# EAGLE design wemos-d1-screw-terminal-v2.0 (EAGLE 9.6.2)
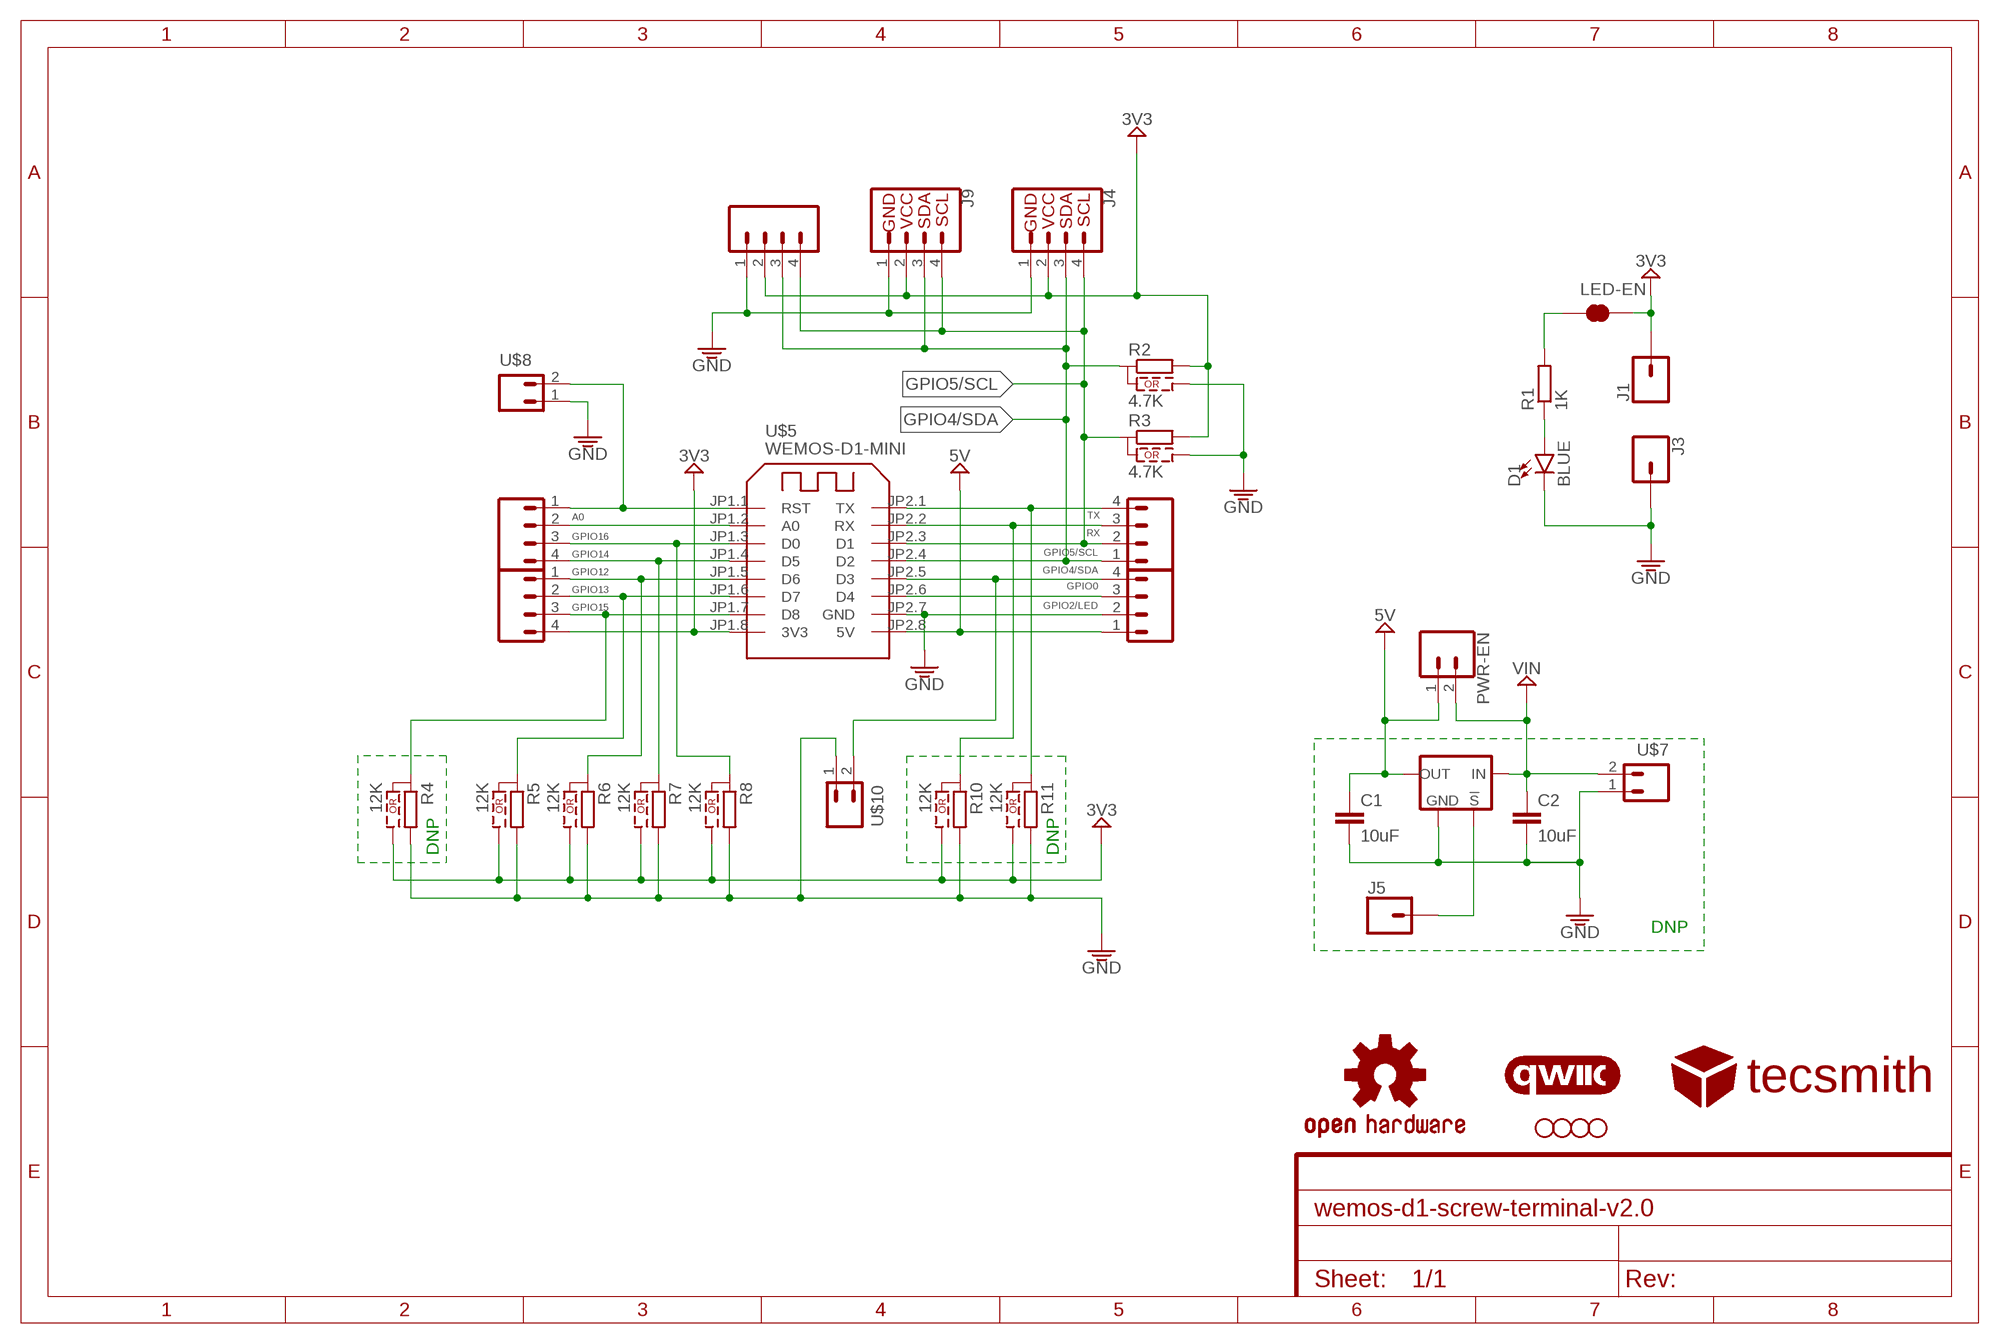
[diagram p0: schematic, sheet 1]

## Parts
C1  10uF  10UF-0805-10V-10%  [0805]
C2  10uF  10UF-0805-10V-10%  [0805]
D1  BLUE  LED-BLUE0603  [LED-0603]
H1  STAND-OFF  [STAND-OFF]
H2  STAND-OFF  [STAND-OFF]
H5  STAND-OFF  [STAND-OFF]
H6  STAND-OFF  [STAND-OFF]
J1  CONN_01PTH_NO_SILK_YES_STOP  [1X01_NO_SILK]
J2  CONN_04PTH  [1X04]
J3  CONN_01PTH_NO_SILK_YES_STOP  [1X01_NO_SILK]
J4  QWIIC_RIGHT_ANGLE  QWIIC_CONNECTORJS-1MM  [JST04_1MM_RA]
J5  CONN_01PTH_NO_SILK_YES_STOP  [1X01_NO_SILK]
J9  QWIIC_RIGHT_ANGLE  QWIIC_CONNECTORJS-1MM  [JST04_1MM_RA]
LED-EN  JUMPER-SMT_2_NC_TRACE_SILK  [SMT-JUMPER_2_NC_TRACE_SILK]
LOGO1  OSHW-LOGOS  [OSHW-LOGO-S]
LOGO2  QWIIC_LOGO_6MM  [QWIIC_6MM]
PWR-EN  CONN_021X02_NO_SILK  [1X02_NO_SILK]
R1  1K  R-EU_R0603  [R0603]
R2  4.7K  SMT-JUMPER_3_0603  [R0603_JMP]
R3  4.7K  SMT-JUMPER_3_0603  [R0603_JMP]
R4  12K  SMT-JUMPER_3_0603  [R0603_JMP]
R5  12K  SMT-JUMPER_3_0603  [R0603_JMP]
R6  12K  SMT-JUMPER_3_0603  [R0603_JMP]
R7  12K  SMT-JUMPER_3_0603  [R0603_JMP]
R8  12K  SMT-JUMPER_3_0603  [R0603_JMP]
R10  12K  SMT-JUMPER_3_0603  [R0603_JMP]
R11  12K  SMT-JUMPER_3_0603  [R0603_JMP]
U$1  CON_04SCREW  [WURTH_2431_3.5MM_4X_SCREW]
U$2  CON_04SCREW  [WURTH_2431_3.5MM_4X_SCREW]
U$3  CON_04SCREW  [WURTH_2431_3.5MM_4X_SCREW]
U$4  CON_04SCREW  [WURTH_2431_3.5MM_4X_SCREW]
U$5  WEMOS-D1-MINI  [WEMOS-D1-MINI]
U$6  POLOLU-VREG  [TO-220+1]
U$7  CON_02SCREW  [WURTH_2431_3.5MM_2X_SCREW]
U$8  JST-PH-2  [JST-PH2]
U$9  TECSMITH-LOGO  [TECSMITH-LOGO]
U$10  JST-PH-2  [JST-PH2]

## Nets
A0: U$1.2 U$5.JP1.2(A0)
GND: C1.2 C2.2 D1.C J2.1 J3.1 J4.1 J9.1 R2.3 R3.3 R4.2 R5.2 R6.2 R7.2 R8.2 R10.2 R11.2 U$3.2 U$5.JP2.7(GND) U$6.GND U$7.1 U$8.1 U$10.1
GPIO0: U$3.4 U$5.JP2.5(D3) U$10.2
GPIO2/LED: U$3.3 U$5.JP2.6(D4)
GPIO4/SDA: J2.3 J4.3 J9.3 R2.1 U$4.1 U$5.JP2.4(D2)
GPIO5/SCL: J2.4 J4.4 J9.4 R3.1 U$4.2 U$5.JP2.3(D1)
GPIO12: R6.1 U$2.1 U$5.JP1.5(D6)
GPIO13: R5.1 U$2.2 U$5.JP1.6(D7)
GPIO14: R7.1 U$1.4 U$5.JP1.4(D5)
GPIO15: R4.1 U$2.3 U$5.JP1.7(D8)
GPIO16: R8.1 U$1.3 U$5.JP1.3(D0)
N$6: D1.A R1.1
N$9: LED-EN.1 R1.2
N$12: J5.1 U$6.!SHDN
RST: U$1.1 U$5.JP1.1(RST) U$8.2
RX: R10.1 U$4.3 U$5.JP2.2(RX)
TX: R11.1 U$4.4 U$5.JP2.1(TX)
VCC: J1.1 J2.2 J4.2 J9.2 LED-EN.2 R2.2 R3.2 R4.3 R5.3 R6.3 R7.3 R8.3 R10.3 R11.3 U$2.4 U$5.JP1.8(3V3) ; supply symbol labelled 3V3
VCC_1: C1.1 PWR-EN.1 U$3.1 U$5.JP2.8(5V) U$6.OUT ; supply symbol labelled 5V
VCC_2: C2.1 PWR-EN.2 U$6.IN U$7.2 ; supply symbol labelled VIN

## Notes on the sheet
- DNP | DNP
- DNP

## Library data of the parts
C1 C2 = SparkFun-Capacitors:10UF: 10.0µF ceramic capacitors A capacitor is a passive two-terminal electrical component used to store electrical energy temporarily in an electric field.; PROD_ID: CAP-11330
D1 = SparkFun-LED:LED-BLUE: Blue SMD LED Used in manufacturing of various products at SparkFun Packages: 0603 - SMD 0603 package [Product Link] <http://www.digikey.com/product-detail/en/SMLE12BC7TT86/511-1589-2-ND/1641808> 1206 - SMD1206 package [Product Link] <http://www.digikey.com/product-detail/en/lite-on-inc/LTST-C150TBKT/160-1643-1-ND/573584> SparkFun Products: ESP8266 Thing-Dev Board <https://www.sparkfun.com/products/13711> RedBoard <https://www.sparkfun.com/products/12757>; PROD_ID: DIO-08575
H1 H2 H5 H6 = SparkFun-Hardware:STAND-OFF: Stand Off Drill holes for mechanically mounting via screws, standoffs, etc. Note: Use the keepout ring to avoid running the screw head into surrounding components. Variant Overviews STAND-OFF - Mechanical footprint for a #4 phillips button head screw. STAND-OFF-TIGHT - Mechanical footprint for a #4 phillips button head screw, Example SparkFun Products Screw - Phillips Head (1/4", 4-40, 10 pack) <https://www.sparkfun.com/products/10453> (PRT-10453) Screw - Phillips Head (1/2", 4-40, 10 pack) <https://www.sparkfun.com/products/10452> (PRT-10452) Screw - Phillips Head (3/4", 4-40, 10 pack) <https://www.sparkfun.com/products/10451> (PRT-10451) Screw - Phillips Head (1", 4-40, 10 pack) <https://www.sparkfun.com/products/10450> (PRT-10450)
J1 J3 J5 = SparkFun-Connectors:CONN_01: Single connection point. Often used as Generic Header-pin footprint for 0.1 inch spaced/style header connections On any of the 0.1 inch spaced packages, you can populate with these: Break Away Headers - Straight <https://www.sparkfun.com/products/116> (PRT-00116) Break Away Male Headers - Right Angle <https://www.sparkfun.com/products/553> (PRT-00553) Female Headers <https://www.sparkfun.com/products/115> (PRT-00115) Break Away Headers - Machine Pin <https://www.sparkfun.com/products/117> (PRT-00117) Break Away Female Headers - Swiss Machine Pin <https://www.sparkfun.com/products/743> (PRT-00743) This device is also useful as a general connection point to wire up your design to another part of your project. Our various solder wires solder well into these plated through hole pads. Hook-Up Wire - Assortment (Stranded, 22 AWG) <https://www.sparkfun.com/products/11375> (PRT-11375) Hook-Up Wire - Assortment (Solid Core, 22 AWG) <https://www.sparkfun.com/products/11367> (PRT-11367) View the entire wire category on our website here <https://www.sparkfun.com/categories/141> Special notes: SMTSO-256-ET is a "flush mount" nut for a 4-40 screw. We mostly use this on specialty testbeds; it is a nice way to connect hardware to your PCB at an adjustable hieght. Also note, the SNAP packages are for using a snappable style connector. We sell a baggie of snaps and they are also used on two LilyPad designs: Snap Assortment - 30 pack (male and female) <https://www.sparkfun.com/products/11347> (DEV-11347) LilyPad Arduino SimpleSnap <https://www.sparkfun.com/products/10941> (DEV-10941) LilyPad SimpleSnap Protoboard <https://www.sparkfun.com/products/10940> (DEV-10940)
J2 = SparkFun-Connectors:CONN_04: Multi connection point. Often used as Generic Header-pin footprint for 0.1 inch spaced/style header connections On any of the 0.1 inch spaced packages, you can populate with these: Break Away Headers - Straight <https://www.sparkfun.com/products/116> (PRT-00116) Break Away Male Headers - Right Angle <https://www.sparkfun.com/products/553> (PRT-00553) Female Headers <https://www.sparkfun.com/products/115> (PRT-00115) Break Away Headers - Machine Pin <https://www.sparkfun.com/products/117> (PRT-00117) Break Away Female Headers - Swiss Machine Pin <https://www.sparkfun.com/products/743> (PRT-00743) For SCREWTERMINALS and SPRING TERMINALS visit here: Screw Terimnals on SparkFun.com <https://www.sparkfun.com/search/results?term=Screw+Terminals> (5mm/3.5mm/2.54mm spacing) This device is also useful as a general connection point to wire up your design to another part of your project. Our various solder wires solder well into these plated through hole pads. Hook-Up Wire - Assortment (Stranded, 22 AWG) <https://www.sparkfun.com/products/11375> (PRT-11375) Hook-Up Wire - Assortment (Solid Core, 22 AWG) <https://www.sparkfun.com/products/11367> (PRT-11367) View the entire wire category on our website here <https://www.sparkfun.com/categories/141> Special notes: Molex polarized connector foot print use with SKU : PRT-08231 with associated crimp pins and housings. 1MM SMD Version SKU: PRT-10208; PROD_ID: CONN-09696
J4 J9 = SparkFun-Connectors:QWIIC_CONNECTOR: SparkFun I2C Standard Qwiic Connector An SMD 1mm pitch JST connector makes it easy and quick (get it? Qwiic?) to connect I2C devices to each other. The Qwiic system <http://www.sparkfun.com/qwiic> enables fast and solderless connection between popular platforms and various sensors and actuators. We carry 200mm <https://www.sparkfun.com/products/14204>, 100mm <https://www.sparkfun.com/products/14205>, 50mm <https://www.sparkfun.com/products/14206>, and breadboard friendly <https://www.sparkfun.com/products/14207> Qwiic cables. We also offer 10 pcs strips <https://www.sparkfun.com/products/14323> the SMD connectors.; PROD_ID: CONN-13694
LED-EN = SparkFun-Jumpers:JUMPER-SMT_2_NC_TRACE: Normally closed trace jumper This jumper has a trace between two pads so it's normally closed (NC). Use a razor knife to open the connection. For best results follow the IPC guidelines for cutting traces: Cutout at least 0.063 mm (0.005 in). Remove all loose material to clean up the cut area. Seal the cut with an approved epoxy. Reapply solder to reclose the connection.
LOGO1 = SparkFun-Aesthetics:OSHW-LOGO: Open-Source Hardware (OSHW) Logo This logo indicates the piece of hardware it is found on incorporates a OSHW license and/or adheres to the definition of open source hardware found here: http://freedomdefined.org/OSHW
LOGO2 = SparkFun-Aesthetics:QWIIC_LOGO: Qwiic Logos for placement on schematic and PCB. The 5.5mm silk logo is best for placing next to Qwiic connector.
PWR-EN = SparkFun-Connectors:CONN_02: Multi connection point. Often used as Generic Header-pin footprint for 0.1 inch spaced/style header connections On any of the 0.1 inch spaced packages, you can populate with these: Break Away Headers - Straight <https://www.sparkfun.com/products/116> (PRT-00116) Break Away Male Headers - Right Angle <https://www.sparkfun.com/products/553> (PRT-00553) Female Headers <https://www.sparkfun.com/products/115> (PRT-00115) Break Away Headers - Machine Pin <https://www.sparkfun.com/products/117> (PRT-00117) Break Away Female Headers - Swiss Machine Pin <https://www.sparkfun.com/products/743> (PRT-00743) For SCREWTERMINALS and SPRING TERMINALS visit here: Screw Terimnals on SparkFun.com <https://www.sparkfun.com/search/results?term=Screw+Terminals> (5mm/3.5mm/2.54mm spacing) This device is also useful as a general connection point to wire up your design to another part of your project. Our various solder wires solder well into these plated through hole pads. Hook-Up Wire - Assortment (Stranded, 22 AWG) <https://www.sparkfun.com/products/11375> (PRT-11375) Hook-Up Wire - Assortment (Solid Core, 22 AWG) <https://www.sparkfun.com/products/11367> (PRT-11367) View the entire wire category on our website here <https://www.sparkfun.com/categories/141> Special notes: Molex polarized connector foot print use with: PRT-08233 with associated crimp pins and housings. 2.54_SCREWTERM for use with PRT-10571. 3.5mm Screw Terminal footprints for PRT-08084 5mm Screw Terminal footprints for use with PRT-08432
R1 = rcl:R-EU_: RESISTOR, European symbol; SPICEPREFIX: R
R2-R8 R10 R11 = __untitled:SMT-JUMPER_3_0603
U$1-U$4 = VinoRodrigues_Custom_Eagle:CON_04SCREW
U$5 = VinoRodrigues_Custom_Eagle:WEMOS-D1-MINI: WEMOS D1 mini: Mini Wi-Fi Board based on ESP-8266 device More details can be found here: https://www.wemos.cc/product/d1-mini.html
U$6 = VinoRodrigues_Custom_Eagle:POLOLU-VREG
U$7 = VinoRodrigues_Custom_Eagle:CON_02SCREW
U$8 U$10 = VinoRodrigues_Custom_Eagle:JST-PH-2
U$9 = VinoRodrigues_Custom_Eagle:TECSMITH-LOGO

## Board
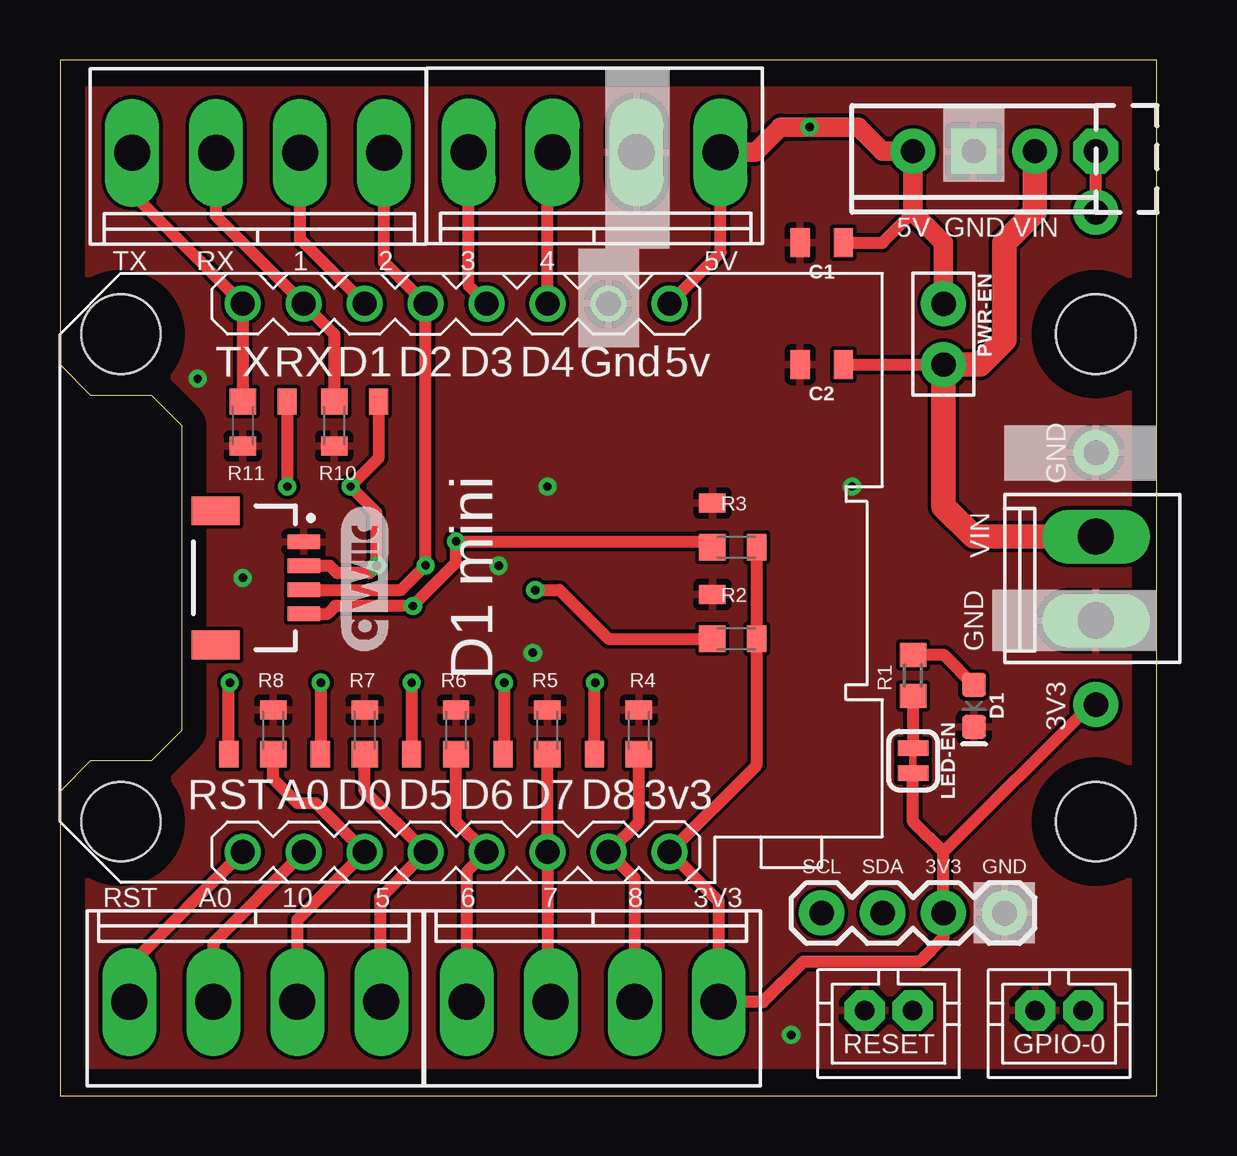
[diagram p1: board, top side]
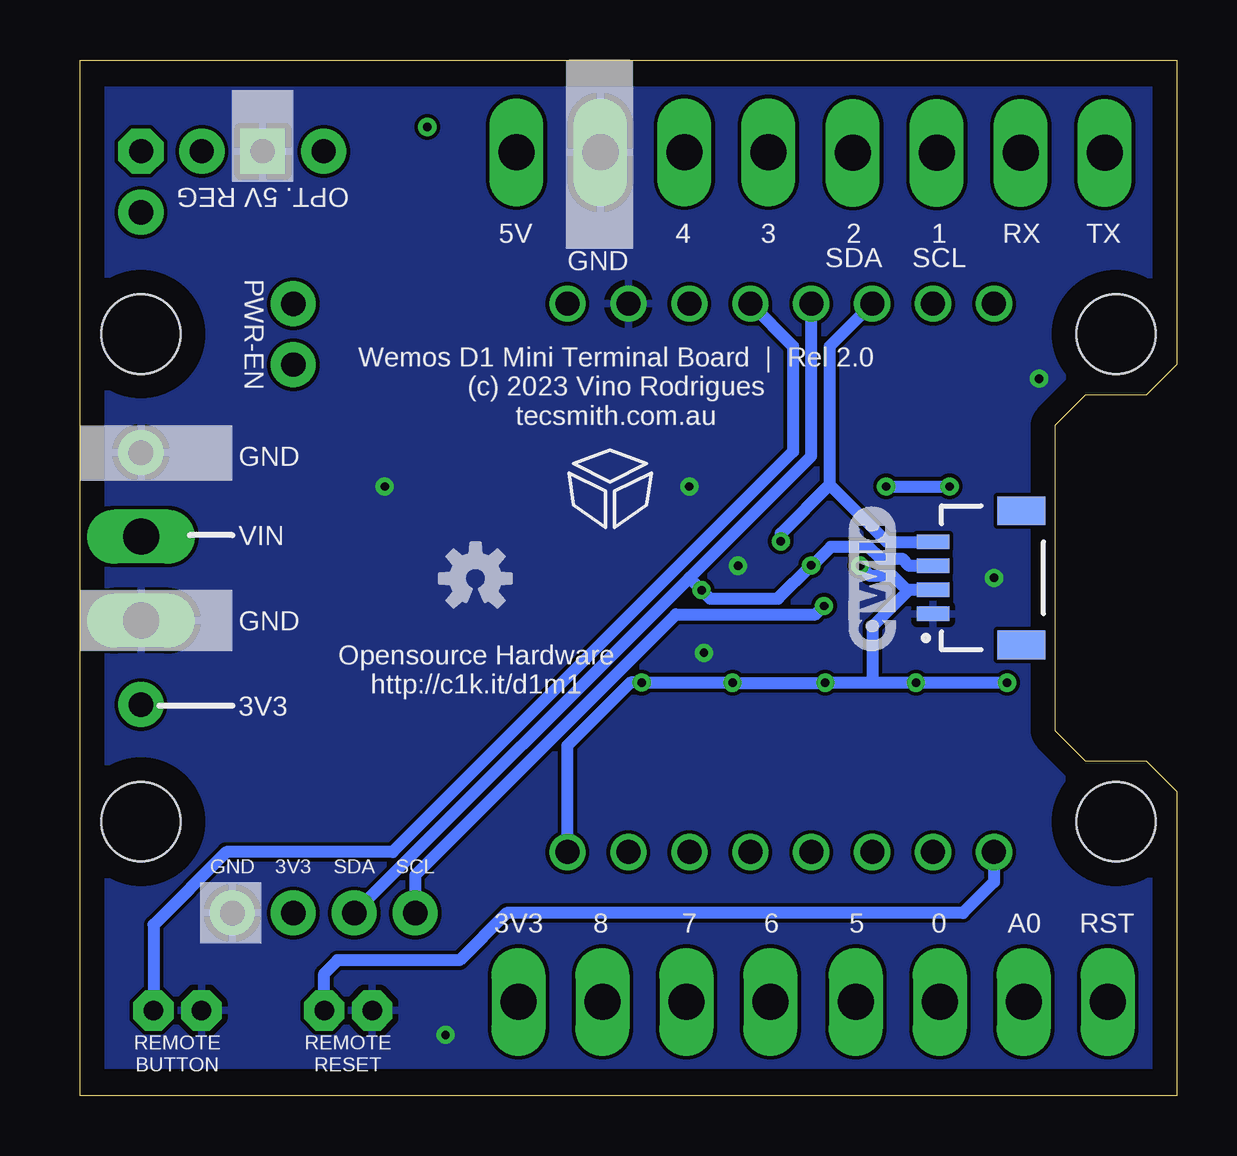
[diagram p2: board, bottom side, seen from below]

Size 45.72 x 43.18 mm. Coordinates in mm from the lower left corner, seen from the top.
Outline: 0,0 45.72,0 45.72,43.18 0,43.18 0,30.48 1.27,29.21 3.81,29.21 5.08,27.94 5.08,15.24 3.81,13.97 1.27,13.97 0,12.7 0,0
Copper layers (1*16): Top 0.035mm / dielectric 1.5mm / Bottom 0.035mm
Design rules "default": minimum track width 6mil, minimum drill 0.35mm, track to track 6mil, track to pad 6mil, pad to pad 6mil, via to via 6mil, smd to smd 6mil, copper to edge 40mil, drill to drill 6mil, minimum pad ring 10mil, minimum via ring 8mil, stop-mask expansion 4mil, vias tented up to drill 0mil, thermal gap 10mil

### Footprints (pad centres in the part's own frame; a part is rotated, then mirrored left to right if it is on the bottom)
0805 = smd 0.8 x 1.2: 1 -0.9,0; 2 0.9,0
LED-0603 = smd 1 x 1: A -0.877,0; C 0.877,0
STAND-OFF = hole 3.302: 0,0
1X01_NO_SILK = drill 1.016 pad 1.88: 1 0,0
1X04 = drill 1.016 pad 1.88: 1 0,0; 2 2.54,0; 3 5.08,0; 4 7.62,0
JST04_1MM_RA = smd 0.6 x 1.35: 1 -1.5,0; 2 -0.5,0; 3 0.5,0; 4 1.5,0 | smd 1.2 x 2: NC1 2.8,-3.675; NC2 -2.8,-3.675
SMT-JUMPER_2_NC_TRACE_SILK = smd 0.66 x 1.27: 1 -0.521,0; 2 0.521,0
1X02_NO_SILK = drill 1.016 pad 1.88: 1 0,0; 2 2.54,0
R0603 = smd 1 x 1.1: 1 -0.85,0; 2 0.85,0
R0603_JMP = smd 1.1 x 1.1: 1 -1,0 | smd 0.8 x 1.1: 2 0.85,0 | smd 1.1 x 0.8: 3 -1,1.85
WURTH_2431_3.5MM_4X_SCREW = drill 1.5 long: 1 0,0; 2 3.5,0; 3 7,0; 4 10.5,0
WEMOS-D1-MINI = drill 1: JP1.1 -11.43,9.525; JP1.2 -11.43,6.985; JP1.3 -11.43,4.445; JP1.4 -11.43,1.905; JP1.5 -11.43,-0.635; JP1.6 -11.43,-3.175; JP1.7 -11.43,-5.715; JP1.8 -11.43,-8.255; JP2.1 11.43,9.525; JP2.2 11.43,6.985; JP2.3 11.43,4.445; JP2.4 11.43,1.905; JP2.5 11.43,-0.635; JP2.6 11.43,-3.175; JP2.7 11.43,-5.715; JP2.8 11.43,-8.255
TO-220+1 = drill 1 pad 1.88 octagon: !SHDN -5.08,0 | drill 1 pad 1.88 square: GND 0,0 | drill 1 pad 1.88: IN -2.54,0; OUT 2.54,0
WURTH_2431_3.5MM_2X_SCREW = drill 1.5 long: 1 0,0; 2 3.5,0
JST-PH2 = drill 0.813 pad 1.676 octagon: 1 1,0; 2 -1,0

### Placement (x,y rotation side)
C1  31.75,35.56 180 top
C2  31.75,30.48 180 top
D1  38.1,16.26 270 top
H1  2.54,31.75 0 top
H2  43.18,31.75 0 top
H5  2.54,11.43 0 top
H6  43.18,11.43 0 top
J1  43.18,16.31 0 top
J2  39.37,7.62 180 top
J3  43.18,26.81 0 top
J4  10.16,21.59 90 bottom
J5  43.18,36.83 0 top
J9  10.16,21.59 270 top
LED-EN  35.56,13.97 270 top
LOGO1  29.24,21.56 0 bottom
LOGO2  12.7,21.59 90 top
LOGO3  QWIIC_LOGO_6MM  [QWIIC_6MM]  12.7,21.59 90 bottom
PWR-EN  36.83,33.02 270 top
R1  35.56,17.53 270 top
R2  28.19,19.05 0 top
R3  28.19,22.86 0 top
R4  24.13,15.24 90 top
R5  20.32,15.24 90 top
R6  16.51,15.24 90 top
R7  12.7,15.24 90 top
R8  8.89,15.24 90 top
R10  11.43,27.94 270 top
R11  7.62,27.94 270 top
U$1  2.89,3.91 0 top
U$2  16.95,3.91 0 top
U$3  27.53,39.33 180 top
U$4  13.51,39.31 180 top
U$5  17.14,21.59 90 top
U$6  38.1,39.37 180 top
U$7  43.18,19.81 90 top
U$8  34.54,3.56 180 top
U$9  23.62,25.4 0 bottom
U$10  41.66,3.56 180 top

### Tracks (layer width: path | path; a pad name or v marks a point on that pad's centre or on a via)
A0
  Top 0.508: U$5.JP1.2 6.39,6.39 U$1.2
GND  (via drill 0.35)
  other vias: 5.74,29.9 7.62,21.59 30.48,2.54 19.71,18.47 33.02,25.4 20.32,25.4 18.29,22.1
  pour Bottom: 0,1.27 45.72,1.27 45.72,41.91 0,41.91 0,30.48 1.27,29.21 3.81,29.21 5.08,27.94 5.08,15.24 3.81,13.97 1.27,13.97 0,12.7
  pour Top: 0,1.27 45.72,1.27 45.72,41.91 0,41.91 0,30.48 1.27,29.21 3.81,29.21 5.08,27.94 5.08,15.24 3.81,13.97 1.27,13.97 0,12.7
GPIO0
  Top 0.508: U$5.JP2.5 17.03,33.77 U$3.4
  Bottom 0.508: U$5.JP2.5 16,31.24 16,26.85 32.69,10.16 39.62,10.16 42.66,7.13 U$10.2
GPIO2/LED
  Top 0.508: U$5.JP2.6 20.32,39.12 U$3.3
GPIO4/SDA  (via drill 0.35)
  Top 0.508: U$4.1 13.51,34.75 U$5.JP2.4 v15.24,22.11 14.22,21.09 J9.3 | R2.1 22.86,19.05 20.82,21.09 v19.82,21.09 v19.81,21.08
  Bottom 0.508: 20.32,21.59 J2.3 | J4.3 11.16,22.09 11.46,22.39 12.37,22.39 12.86,22.89 14.42,22.89 15.22,22.09 v15.24,22.11 16.62,20.73 19.46,20.73 v19.81,21.08 20.32,21.59 | 20.32,21.59 15.24,26.67 U$5.JP2.4
GPIO5/SCL  (via drill 0.35)
  Top 0.508: U$5.JP2.3 10.01,35.71 U$4.2 | R3.1 26.94,23.11 v16.51,23.11 16.51,22.23 v14.71,20.42 11.48,20.42 11.15,20.09 J9.4
  Bottom 0.508: J2.4 31.75,9.2 20.88,20.07 15.06,20.07 v14.71,20.42 | U$5.JP2.3 14.48,31.24 14.48,25.48 | 14.48,25.48 12.09,23.09 J4.4 | 14.48,25.48 16.51,23.44 v16.51,23.11 16.49,23.09
GPIO12
  Top 0.508: U$2.1 16.95,9.33 U$5.JP1.5 16.51,11.43 R6.1
GPIO13
  Top 0.508: U$2.2 20.32,4.04 U$5.JP1.6 R5.1
GPIO14
  Top 0.508: U$1.4 13.34,3.96 13.34,8.26 U$5.JP1.4 12.7,12.7 R7.1
GPIO15
  Top 0.508: U$2.3 23.95,9.07 U$5.JP1.7 24.13,11.43 R4.1
GPIO16
  Top 0.508: U$1.3 9.89,7.35 U$5.JP1.3 10.67,12.19 9.91,12.19 8.89,13.21 R8.1
N$6
  Top 0.508: D1.A 36.86,18.38 R1.1
N$9
  Top 0.508: R1.2 LED-EN.1
N$12
  Top 0.508: J5.1 U$6.!SHDN
RST
  Top 0.508: U$5.JP1.1 2.89,5.43 U$1.1
  Bottom 0.508: U$5.JP1.1 7.62,8.91 8.91,7.62 27.94,7.62 29.91,5.65 34.99,5.65 35.54,5.1 U$8.2
RX
  Top 0.508: U$4.3 6.51,36.67 U$5.JP2.2 11.43,31.75 R10.1
TX
  Top 0.508: U$4.4 3.01,37.63 U$5.JP2.1 R11.1
VCC  (via drill 0.35)
  Top 0.508: R8.3 7.04,17.18 v7.08,17.22 | v10.87,17.22 10.87,14.26 R7.3 | R6.3 v14.66,17.22 | v18.52,17.22 18.52,14.29 R5.3 | R4.3 22.28,17.2 v22.3,17.23 | R10.3 13.28,26.58 12.12,25.41 v12.12,25.4 13.18,24.33 13.18,22.12 v13.21,22.1 12.9,21.79 11.56,21.79 11.26,22.09 J9.2 | R11.3 v9.47,25.4 | R3.2 R2.2 29.04,13.8 U$5.JP1.8 27.45,8.11 U$2.4 29.31,3.91 30.99,5.59 35.81,5.59 36.83,6.6 J2.2 36.83,10.16 | 36.83,10.16 35.56,11.43 LED-EN.2 | 36.83,10.16 42.98,16.31 J1.1
  Bottom 0.508: J4.2 11.26,21.09 | 11.26,21.09 11.86,21.69 12.8,21.69 v13.21,22.1 | v7.08,17.22 v10.87,17.22 12.7,17.22 | 12.7,17.22 v14.66,17.22 v18.52,17.22 v18.52,17.23 v22.3,17.23 22.78,17.23 25.4,14.61 U$5.JP1.8 | v12.12,25.4 v9.47,25.4 | 11.26,21.09 11.26,21 12.7,19.56 12.7,17.22
VCC_1  (via drill 0.35)
  Top 0.508: C1.1 34.29,35.56 35.56,36.83 | U$5.JP2.8 27.53,35.15 U$3.1
  Top 0.813: PWR-EN.1 36.83,35.56 35.56,36.83 U$6.OUT 34.29,39.37 33.27,40.39 v31.24,40.39 30.03,40.39 28.98,39.33 U$3.1
VCC_2
  Top 0.508: C2.1 PWR-EN.2
  Top 1.016: U$6.IN 40.64,36.83 39.37,35.56 39.37,31.5 38.35,30.48 PWR-EN.2 36.83,24.57 38.09,23.31 U$7.2

### Text on the board
bPlace: Wemos D1 Mini Terminal Board | Rel 2.0 / (c) 2023 Vino Rodrigues / tecsmith.com.au | Opensource Hardware / http://c1k.it/d1m1
tNames: 5V | GND | VIN | TX | RX | 1 | 2 | 3 | 4 | 5V | GND | VIN | GND | 3V3 | SCL | SDA | 3V3 | GND | RST | A0 | 10 | 5 | 6 | 7 | 8 | 3V3 | RESET | GPIO-0
bNames: OPT. 5V REG | TX | RX | 1 | 2 | 3 | 4 | 5V | SCL | SDA | GND | PWR-EN | GND | VIN | GND | 3V3 | SCL | SDA | 3V3 | GND | RST | A0 | 0 | 5 | 6 | 7 | 8 | 3V3 | REMOTE / RESET | REMOTE / BUTTON